# EAGLE design Peizo50V (EAGLE 5.11)
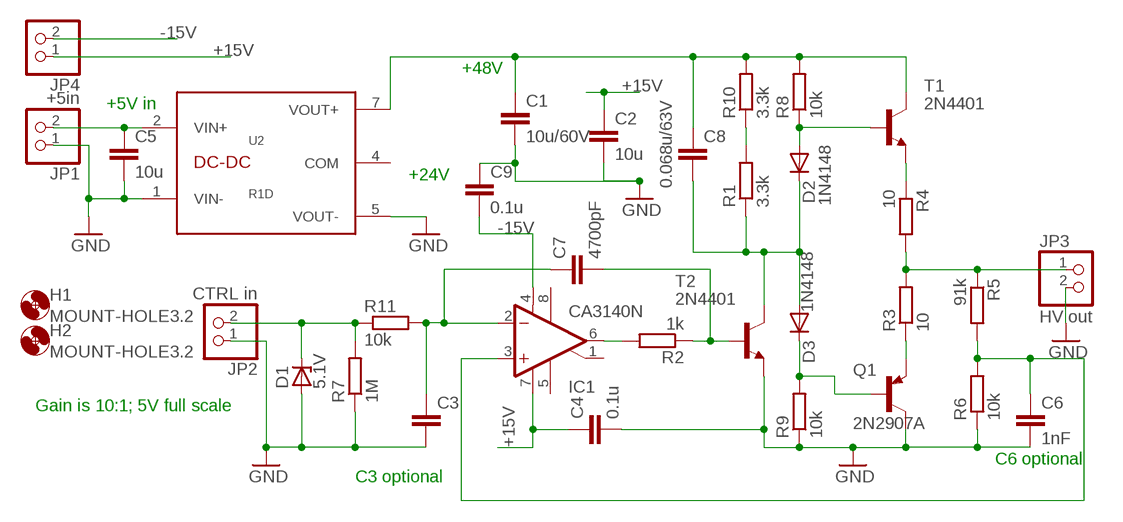
[diagram p0: schematic, sheet 1]

## Parts
C1  10u/60V  C-EU050-030X075  [C050-030X075]
C2  10u  C-EU050-030X075  [C050-030X075]
C3  C-EU050-030X075  [C050-030X075]
C4  0.1u  C-EU050-030X075  [C050-030X075]
C5  10u  C-EU050-030X075  [C050-030X075]
C6  1nF  C-EU050-025X075  [C050-025X075]
C7  4700pF  C-EU050-025X075  [C050-025X075]
C8  0.068u/63V  C-EU050-025X075  [C050-025X075]
C9  0.1u  C-EU050-025X075  [C050-025X075]
D1  5.1V  1N4728  [DO41Z10]
D2  1N4148  1N4148DO35-7  [DO35-7]
D3  1N4148  1N4148DO35-7  [DO35-7]
H1  MOUNT-HOLE3.2  [3,2]
H2  MOUNT-HOLE3.2  [3,2]
IC1  CA3140N  [DIL08]
JP1  +5in  PINHD-1X2  [1X02]
JP2  CTRL in  PINHD-1X2  [1X02]
JP3  HV out  PINHD-1X2  [1X02]
JP4  PINHD-1X2  [1X02]
Q1  2N2907A  [TO18]
R1  3.3k  R-EU_0207/10  [0207/10]
R2  1k  R-EU_0207/10  [0207/10]
R3  10  R-EU_0207/10  [0207/10]
R4  10  R-EU_0207/10  [0207/10]
R5  91k  R-EU_0207/10  [0207/10]
R6  10k  R-EU_0207/10  [0207/10]
R7  1M  R-EU_0204/7  [0204/7]
R8  10k  R-EU_0207/10  [0207/10]
R9  10k  R-EU_0207/10  [0207/10]
R10  3.3k  R-EU_0207/10  [0207/10]
R11  10k  R-EU_0207/10  [0207/10]
T1  2N4401  2N4401-NPN-TO92-EBC  [TO92-EBC]
T2  2N4401  2N4401-NPN-TO92-EBC  [TO92-EBC]
U2  R1D  [R1D]

## Nets
+15V: C2.1 C4.1 IC1.7(V+) JP4.1
-15V: C9.2 IC1.4(V-) JP4.2
GND: C1.2 C2.2 C3.2 C4.2 C5.2 C6.2 C9.1 D1.A JP1.1 JP2.1 JP3.2 Q1.3(C) R6.1 R7.1 R9.1 T2.E U2.1(VIN-) U2.5(VOUT-)
N$1: D2.A R8.1 T1.B
N$2: R4.1 T1.E
N$3: JP3.1 R3.2 R4.2 R5.1
N$4: Q1.1(E) R3.1
N$5: C6.1 IC1.3(+IN) R5.2 R6.2
N$6: C5.1 JP1.2 U2.2(VIN+)
N$7: D1.C JP2.2 R7.2 R11.1
N$8: D3.C Q1.2(B) R9.2
N$9: C8.2 D2.C D3.A R1.1 T2.C
N$10: C7.2 R2.1 T2.B
N$11: R1.2 R10.1
N$14: C3.1 C7.1 IC1.2(-IN) R11.2
N$15: IC1.6(OUT) R2.2
VOUT+: C1.1 C8.1 R8.2 R10.2 T1.C U2.7(VOUT+)
Unconnected: IC1.1(ON/CMP) IC1.5(ON) IC1.8(CMP) U2.4(COM)

## Notes on the sheet
- +48V
- +5V in
- +24V
- Gain is 10:1; 5V full scale
- C6 optional
- C3 optional

## Library data of the parts
C1-C9 = rcl:C-EU: CAPACITOR, European symbol
D1 = diode:1N4728: Z DIODE 3.3 V, 1W, 5 percent
D2 D3 = diode:1N4148: DIODE high speed (Philips)
H1 H2 = holes:MOUNT-HOLE: MOUNTING HOLE with drill center marker
IC1 = linear:CA3140: OP AMP
JP1-JP4 = pinhead:PINHD-1X2: PIN HEADER
Q1 = transistor-pnp:2N2907*: PNP Transistor
R1-R11 = rcl:R-EU_: RESISTOR, European symbol
T1 T2 = transistor-neu-to92:*-NPN-: NPN Transistror
U2 = custom_parts:R1D: Recom R1D xxxx DC-DC converter, dual output

## Board
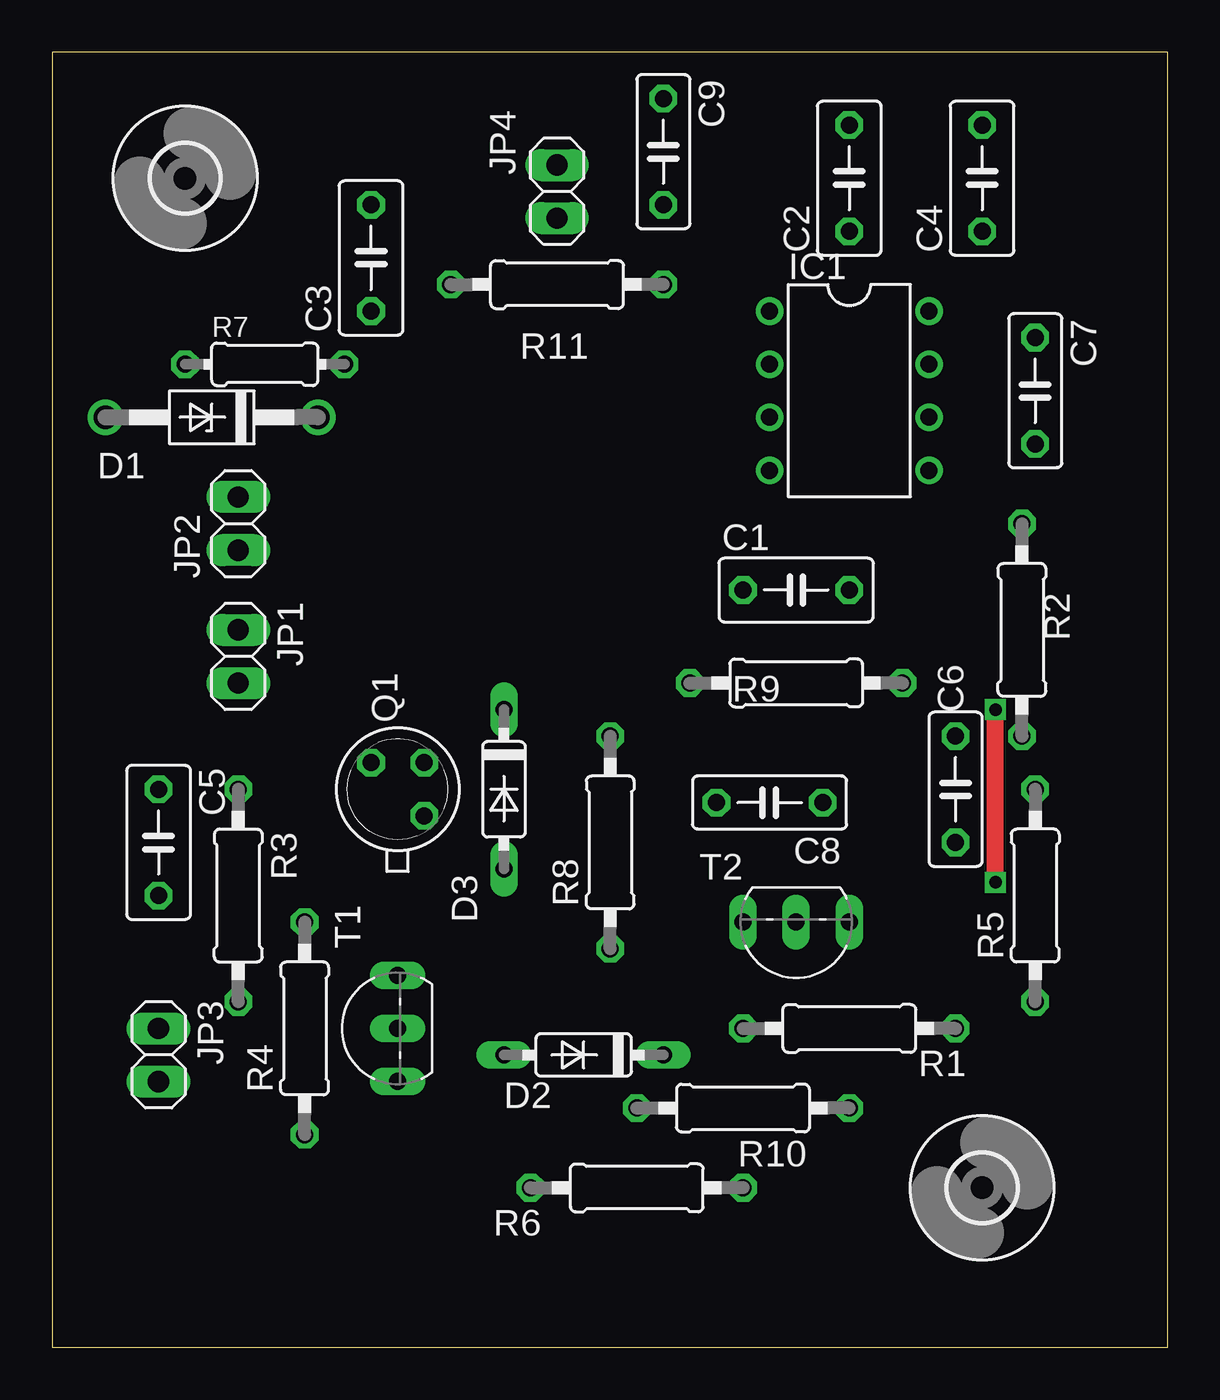
[diagram p1: board, top side]
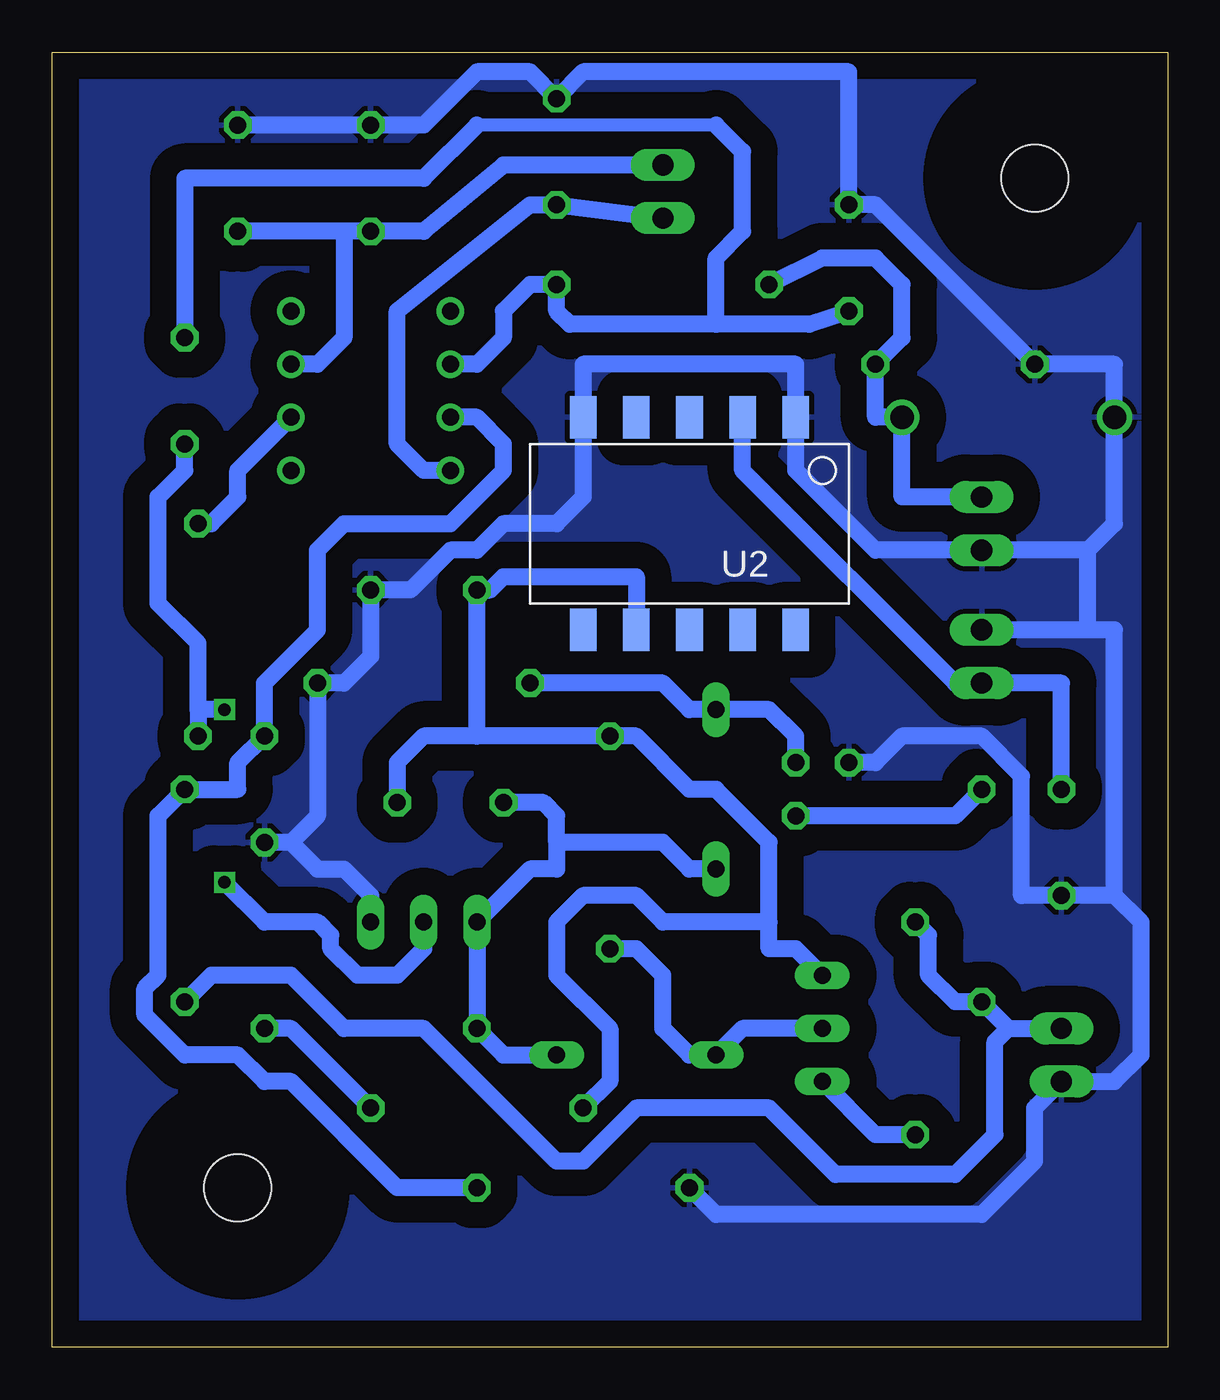
[diagram p2: board, bottom side, seen from below]

Size 53.32 x 61.9 mm. Coordinates in mm from the lower left corner, seen from the top.
Outline: 0,0 53.32,0 53.32,61.9 0,61.9 0,0
Copper layers (1*16): Top 0.035mm / dielectric 1.5mm / Bottom 0.035mm
Design rules "default": minimum track width 10mil, minimum drill 24mil, track to track 8mil, track to pad 8mil, pad to pad 8mil, via to via 8mil, smd to smd 8mil, copper to edge 40mil, drill to drill 8mil, minimum pad ring 10mil, minimum via ring 8mil, stop-mask expansion 4mil, vias tented up to drill 0mil, thermal gap 10mil

### Footprints (pad centres in the part's own frame; a part is rotated, then mirrored left to right if it is on the bottom)
C050-030X075 = drill 0.813 octagon: 1 -2.54,0; 2 2.54,0
C050-025X075 = drill 0.813 octagon: 1 -2.54,0; 2 2.54,0
DO41Z10 = drill 1.118 round: A 5.08,0; C -5.08,0
DO35-7 = drill 0.813 long: A 3.81,0; C -3.81,0
3,2 = hole 3.2: 0,0
DIL08 = drill 0.813 pad 1.27 round: 1 -3.81,-3.81; 2 -1.27,-3.81; 3 1.27,-3.81; 4 3.81,-3.81; 5 3.81,3.81; 6 1.27,3.81; 7 -1.27,3.81; 8 -3.81,3.81
1X02 = drill 1.016 long: 1 -1.27,0; 2 1.27,0
TO18 = drill 0.813 octagon: 1 -1.27,-1.27; 2 1.27,-1.27; 3 1.27,1.27
0207/10 = drill 0.813 octagon: 1 -5.08,0; 2 5.08,0
0204/7 = drill 0.813 octagon: 1 -3.81,0; 2 3.81,0
TO92-EBC = drill 0.813 long: B 0,-1.27; C 2.54,-1.27; E -2.54,-1.27
R1D = smd 1.27 x 2.032: 1 -5.08,-5.08; 2 -2.54,-5.08; 3 0,-5.08; 4 2.54,-5.08; 5 5.08,-5.08; 6 5.08,5.08; 7 2.54,5.08; 8 0,5.08; 9 -2.54,5.08; 10 -5.08,5.08

### Placement (x,y rotation side)
C1  35.56,36.2 0 top
C2  38.1,55.88 90 top
C3  15.24,52.07 90 top
C4  44.45,55.88 90 top
C5  5.08,24.13 270 top
C6  43.18,26.67 270 top
C7  46.99,45.72 270 top
C8  34.29,26.04 180 top
C9  29.21,57.15 270 top
D1  7.62,44.45 180 top
D2  25.4,13.97 180 top
D3  21.59,26.67 270 top
H1  6.35,55.88 0 top
H2  44.45,7.62 0 top
IC1  38.1,45.72 270 top
JP1  8.89,33.02 270 top
JP2  8.89,39.37 90 top
JP3  5.08,13.97 270 top
JP4  24.13,55.25 270 top
Q1  16.51,26.67 90 top
R1  38.1,15.24 0 top
R2  46.35,34.29 90 top
R3  8.89,21.59 270 top
R4  12.06,15.24 90 top
R5  46.99,21.59 90 top
R6  27.94,7.62 0 top
R7  10.16,46.99 0 top
R8  26.67,24.13 90 top
R9  35.56,31.75 180 top
R10  33.02,11.43 180 top
R11  24.13,50.8 0 top
T1  15.24,15.24 90 top
T2  35.56,19.05 180 top
U2  22.86,39.37 180 bottom

### Tracks (layer width: path | path; a pad name or v marks a point on that pad's centre or on a via)
+15V
  Bottom 0.813: JP4.1 31.75,56.52 35.56,53.34 C2.1 39.37,53.34 | 39.37,53.34 C4.1 | IC1.7 40.64,46.99 39.37,48.26 39.37,53.34
-15V
  Bottom 0.813: JP4.2 C9.2 30.48,54.61 36.83,49.53 36.83,43.18 35.56,41.91 IC1.4
GND
  Bottom 0.813: 2.54,21.59 1.27,20.32 1.27,13.97 2.54,12.7 JP3.2 6.35,11.43 6.35,8.89 8.89,6.35 21.59,6.35 R6.1 | 2.54,21.59 C5.2 6.99,21.59 6.99,27.3 8.89,29.21 12.7,29.21 13.97,27.94 Q1.3 | 3.81,38.1 JP2.1 13.97,38.1 17.78,41.91 U2.1 17.78,46.99 27.94,46.99 U2.5 27.94,40.64 29.21,39.37 31.75,39.37 33.02,38.1 34.29,38.1 36.2,36.2 C1.2 38.1,33.02 39.37,31.75 R9.1 40.64,25.4 41.91,24.13 | 3.81,38.1 2.54,39.37 D1.A 2.54,46.99 R7.1 13.97,54.61 C3.2 15.24,60.96 27.94,60.96 C9.1 30.48,60.96 33.02,60.96 35.56,58.42 C2.2 C4.2 | 3.81,34.29 JP1.1 | 3.81,34.29 3.81,38.1 | 41.91,24.13 C6.2 | 3.81,34.29 2.54,34.29 2.54,21.59 | T2.E 38.1,21.59 39.37,22.86 40.64,22.86 41.91,24.13
  pour Bottom (isolate 1.27): 0,0 0,61.6 52.7,61.6 52.7,0
N$1
  Bottom 0.813: T1.B 20.32,15.24 D2.A 22.86,13.97 24.13,15.24 24.13,17.78 25.4,19.05 R8.1
N$2
  Bottom 0.813: T1.E 13.97,10.16 R4.1
N$3
  Bottom 0.813: 7.62,15.24 8.26,14.61 8.26,10.16 10.16,8.26 15.88,8.26 19.05,11.43 25.4,11.43 27.94,8.89 29.21,8.89 35.56,15.24 39.37,15.24 41.91,17.78 45.72,17.78 R5.1 | 7.62,15.24 JP3.1 | 7.62,15.24 R3.2 10.16,16.51 11.43,17.78 11.43,19.68 R4.2
N$4
  Bottom 0.813: Q1.1 10.16,25.4 R3.1
N$5
  Bottom 0.813: IC1.3 33.02,44.45 31.75,43.18 31.75,41.91 34.29,39.37 39.37,39.37 40.64,38.1 40.64,34.29 43.18,31.75 C6.1 44.45,27.94 44.45,26.67 R5.2 48.26,25.4 48.26,17.78 48.9,17.14 48.9,15.88 46.99,13.97 44.45,13.97 43.18,12.7 41.91,12.7 36.83,7.62 R6.2
N$6
  Bottom 0.813: C5.1 5.08,31.75 JP1.2 10.16,31.75 20.32,41.91 U2.2
N$7
  Bottom 0.813: JP2.2 12.7,40.64 D1.C 13.97,44.45 R7.2 12.7,48.26 12.7,50.8 13.97,52.07 16.51,52.07 R11.1
N$8
  Bottom 0.813: Q1.2 17.78,29.21 19.05,30.48 D3.C 22.86,30.48 24.13,31.75 R9.2
N$9
  Bottom 0.813: C8.2 29.84,26.04 29.21,25.4 29.21,24.13 | 29.21,24.13 29.21,22.86 30.48,22.86 T2.C R1.1 31.75,13.97 D2.C | D3.A 22.86,22.86 24.13,24.13 29.21,24.13
N$10  (via drill 0.6)
  Top 0.813: v45.09,22.22 v45.09,30.48
  Bottom 0.813: C7.2 46.99,41.91 48.26,40.64 48.26,35.56 46.35,33.66 46.35,30.48 | 46.35,30.48 R2.1 | T2.B 35.56,19.05 36.83,17.78 38.73,17.78 40.01,19.05 40.01,19.68 40.64,20.32 43.18,20.32 v45.09,22.22 | v45.09,30.48 46.35,30.48
N$11
  Bottom 0.813: R10.1 41.91,15.24 R1.2
N$14
  Bottom 0.61: 21.59,58.42 33.02,58.42
  Bottom 0.813: C3.1 17.14,48.9 21.59,48.9 | 21.59,48.9 28.57,48.9 29.21,49.53 R11.2 30.48,50.8 31.75,49.53 31.75,48.26 33.02,46.99 IC1.2 | C7.1 46.99,55.88 35.56,55.88 33.02,58.42 | 21.59,58.42 20.32,57.15 20.32,53.34 21.59,52.07 21.59,48.9
N$15
  Bottom 0.813: R2.2 45.72,39.37 44.45,40.64 44.45,41.91 IC1.6
VOUT+
  Bottom 0.813: T1.C 17.78,19.05 19.05,19.05 19.05,20.32 | U2.7 25.4,36.83 31.75,36.83 32.38,36.2 C1.1 33.02,29.21 | 33.02,29.21 R8.2 25.4,29.21 22.86,26.67 21.59,26.67 19.05,24.13 19.05,20.32 | C8.1 36.83,27.94 35.56,29.21 33.02,29.21 | R10.2 26.67,12.7 26.67,15.24 29.21,17.78 29.21,20.32 27.94,21.59 25.4,21.59 24.13,20.32 19.05,20.32